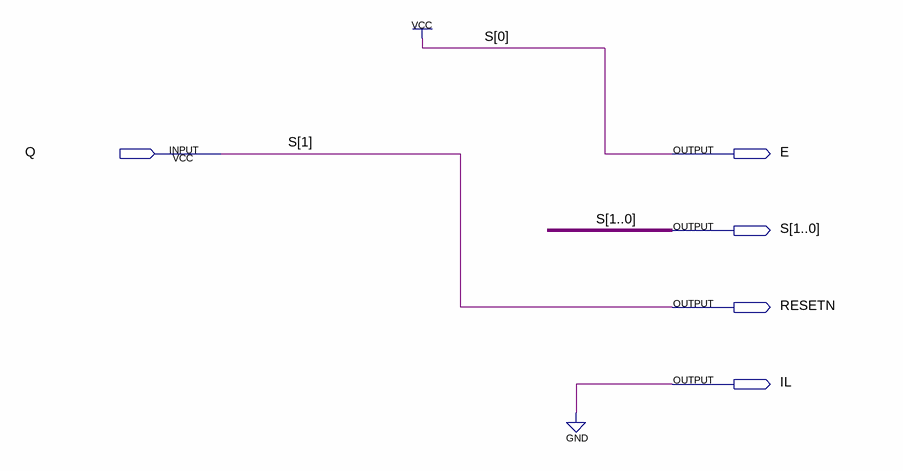
[diagram p0: schematic sheet]
// Quartus schematic OUTPUT_CTRL.bdf as structural Verilog: 0 symbols, 5 pins
module OUTPUT_CTRL (
  input  Q,
  output E,
  output [1:0] S,
  output RESETN,
  output IL
);


  assign E = 1'b1;
  assign IL = 1'b0;
  assign RESETN = Q;
  assign S = {Q, 1'b1};
endmodule
